# Altium schematic sheet CurrentSense_InputProcessing.SchDoc
size A; SheetNumber: 4; SheetTotal: 5
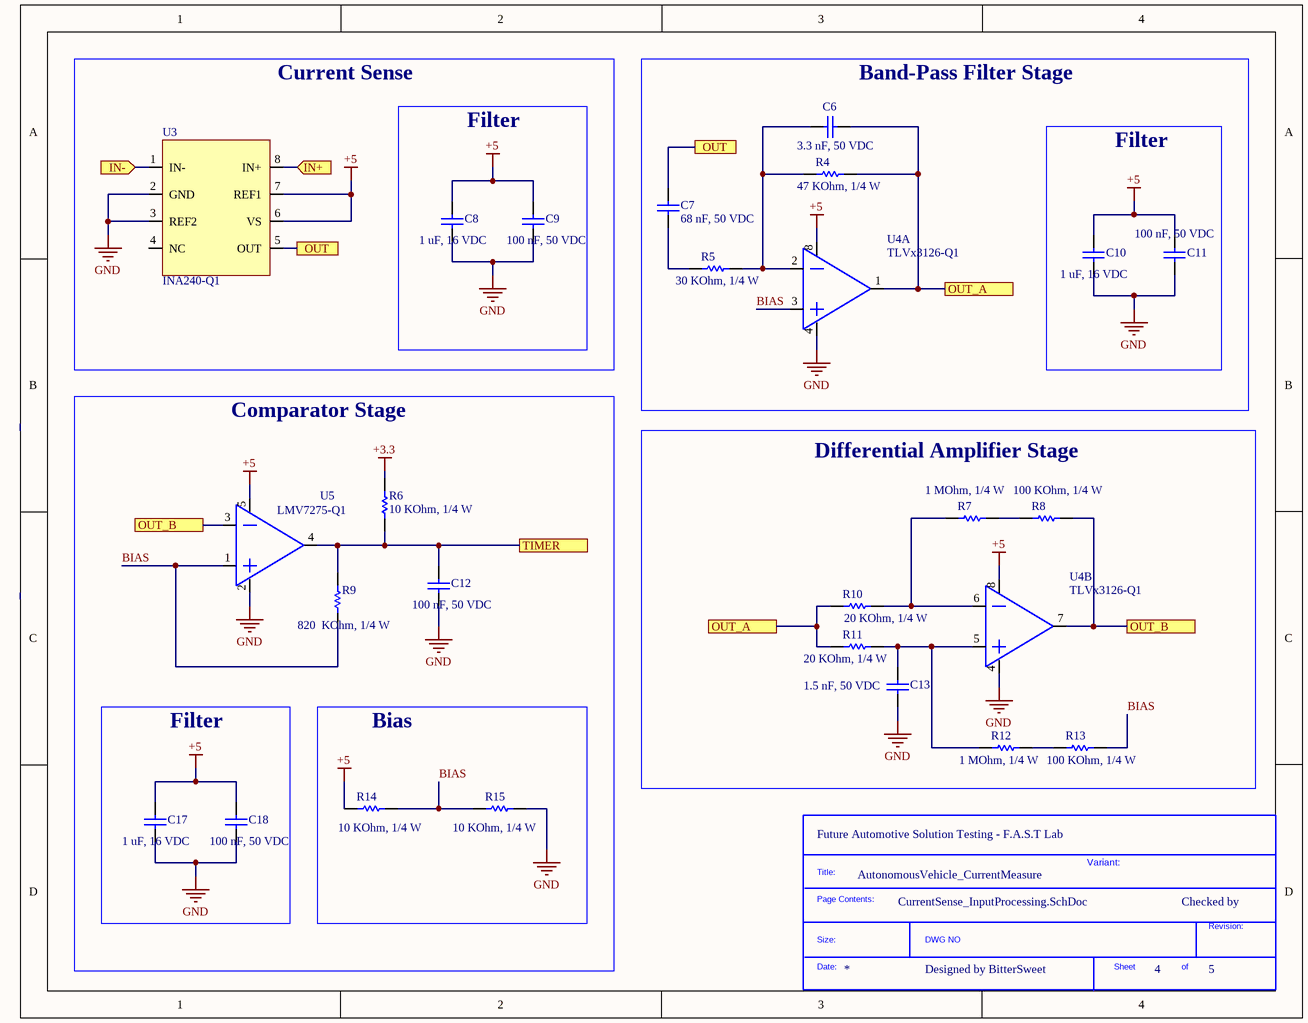
[diagram p0: CurrentSense_InputProcessing.SchDoc]

## Parts
*?  SDTitleBlock  (value not drawn)  (graphical)
C6  3.3 nF, 50 VDC  [CAP_0603]
C7  68 nF, 50 VDC  [CAP_0603]
C8  1 uF, 16 VDC  [CAP_0603]
C9  100 nF, 50 VDC  [CAP_0603]
C10  1 uF, 16 VDC  [CAP_0603]
C11  100 nF, 50 VDC  [CAP_0603]
C12  100 nF, 50 VDC  [CAP_0603]
C13  1.5 nF, 50 VDC  [CAP_0603]
C17  1 uF, 16 VDC  [CAP_0603]
C18  100 nF, 50 VDC  [CAP_0603]
R4  47 KOhm, 1/4 W  [resistor_0603]
R5  30 KOhm, 1/4 W  [resistor_0603]
R6  10 KOhm, 1/4 W  [resistor_0603]
R7  1 MOhm, 1/4 W  [resistor_0603]
R8  100 KOhm, 1/4 W  [resistor_0603]
R9  820  KOhm, 1/4 W  [resistor_0603]
R10  20 KOhm, 1/4 W  [resistor_0603]
R11  20 KOhm, 1/4 W  [resistor_0603]
R12  1 MOhm, 1/4 W  [resistor_0603]
R13  100 KOhm, 1/4 W  [resistor_0603]
R14  10 KOhm, 1/4 W  [resistor_0603]
R15  10 KOhm, 1/4 W  [resistor_0603]
U3  INA240-Q1  [INA240-Q1-SOIC-8]
U4  TLVx3126-Q1  [TLVx316-Q1-VSSOP8]  (parts A,B of 2)
U5  LMV7275-Q1  [LMV7275-Q1]

## Blocks framed on the sheet
Current Sense: U3
Band-Pass Filter Stage: C6 C7 R4 R5 U4
Filter: C8 C9
Filter: C10 C11
Comparator Stage: C12 R6 R9 U5
Differential Amplifier Stage: C13 R7 R8 R10-R13 U4
Filter: C17 C18
Bias: R14 R15

## Ports
IN+ (in), IN- (in), OUT, OUT_A, OUT_B, TIMER

## Nets
+3.3: R6.2
+5: C8.2 C9.2 C10.2 C11.2 C17.2 C18.2 R14.2 U3.6(VS) U3.7(REF1) U4.8(VCC) U5.5(V+)
GND: C8.1 C9.1 C10.1 C11.1 C12.1 C13.1 C17.1 C18.1 R15.1 U3.2(GND) U3.3(REF2) U4.4(GND) U5.2(V-)
BIAS: R9.1 R13.2 R14.1 R15.2 U4.3(INA+) U5.1(IN+)
IN+: U3.8(IN+) ; port IN+
IN-: U3.1(IN-) ; port IN-
OUT: C7.2 U3.5(OUT) ; port OUT
OUT_A: C6.2 R4.2 R10.1 R11.1 U4.1(OUTA) ; port OUT_A
OUT_B: R8.2 U4.7(OUTB) U5.3(IN-) ; port OUT_B
TIMER: C12.2 R6.1 R9.2 U5.4(OUT) ; port TIMER
NetC6_1: C6.1 R4.1 R5.2 U4.2(INA-)
NetC7_1: C7.1 R5.1
NetC13_2: C13.2 R11.2 R12.1 U4.5(INB+)
NetR7_1: R7.1 R10.2 U4.6(INB-)
NetR7_2: R7.2 R8.1
NetR12_2: R12.2 R13.1

Not connected (* = marked no-connect by the designer): U3 4(NC)

## Notes on the sheet
- (near *?) Future Automotive Solution Testing - F.A.S.T Lab
- AutonomousVehicle_CurrentMeasure
- Variant:
- Checked by
- Designed by BitterSweet
- (in symbol SDTitleBlock) Title:; Page Contents:; Revision:; Size:; DWG NO; Date:; Sheet; of

## Library data of the parts
C6 = 0106033320550: CAP, size 0603, 3.3 nF, 50 VDC; Manufacture Name: TDK; Manufacture SN: CGA3E2C0G1H332J080AE; Capacitance: 3.3 nF; Tolerance: +/-5%; Voltage Rating DC: 50 VDC; ComponentLink2Description: Datasheet; ComponentLink2URL: https://product.tdk.com/system/files/dam/doc/product/capacitor/ceramic/mlcc/catalog/mlcc_automotive_soft_en.pdf?ref_disty=mouser; Operating Temperature: -55 to +125degC; Packaging: Tape and Reel; Mounting Technology: SMT; Size: 0603; Supplier 1 Name: Mouser; Supplier 1 SN: 810-CGA3E2C0G1H332J8; Supplier 1 URL: https://www.mouser.com/ProductDetail/TDK/CGA3E2C0G1H332J080AE?qs=P1JMDcb91o59%252BuVOytSHFw%3D%3D&utm_source=mouser-refine-download&utm_medium=file&utm_campaign=CGA3E2C0G1H332J080AE&utm_content=TDK; Supplier 2 Name: Digi-Key; Supplier 2 SN: 445-CGA3E2C0G1H332J080AETR-ND; Supplier 2 URL: https://www.digikey.com/en/products/detail/tdk-corporation/cga3e2c0g1h332j080ae/11697916; Supplier 3 Name: thegioiic; Supplier 3 SN: N/A; Supplier 3 URL: https://www.thegioiic.com/tu-gom-0603-3-3nf-50v; Value: 3.3 nF, 50 VDC
C7 = 0106036831050: CAP, size 0603, 68 nF, 50 VDC; Manufacture Name: TDK; Manufacture SN: CGA3E2X7R1H683K080AA; Capacitance: 68 nF; Tolerance: +/-10%; Voltage Rating DC: 50 VDC; ComponentLink2Description: Datasheet; ComponentLink2URL: https://product.tdk.com/system/files/dam/doc/product/capacitor/ceramic/mlcc/catalog/mlcc_automotive_general_en.pdf?ref_disty=mouser; Operating Temperature: -55 to +125degC; Packaging: Tape and Reel; Mounting Technology: SMT; Size: 0603; Supplier 1 Name: Mouser; Supplier 1 SN: 810-CGA3E2X7R1H683K; Supplier 1 URL: https://www.mouser.com/ProductDetail/TDK/CGA3E2X7R1H683K080AA?qs=NRhsANhppD%252BWyOHUcAY%252Bxg%3D%3D&utm_source=mouser-refine-download&utm_medium=file&utm_campaign=CGA3E2X7R1H683K080AA&utm_content=TDK; Supplier 2 Name: Digi-Key; Supplier 2 SN: 445-5665-2-ND; Supplier 2 URL: https://www.digikey.com/en/products/detail/tdk-corporation/cga3e2x7r1h683k080aa/2443143; Supplier 3 Name: thegioiic; Supplier 3 SN: N/A; Supplier 3 URL: https://www.thegioiic.com/tu-gom-0603-68nf-50v; Value: 68 nF, 50 VDC
C8 C10 C17 = 0106031051016: CAP, size 0603, 1 uF, 16 VDC; Manufacture Name: Samsung Electro-Mechanics; Manufacture SN: CL10B105KO8NNWC; Capacitance: 1 uF; Tolerance: +/-10%; Voltage Rating DC: 16 VDC; ComponentLink2Description: Datasheet; ComponentLink2URL: https://www.mouser.vn/datasheet/2/585/Samsung_MLCC_1837944-1929650.pdf; Operating Temperature: -55 to +125degC; Packaging: Tape and Reel; Mounting Technology: SMT; Size: 0603; Supplier 1 Name: Mouser; Supplier 1 SN: 187-CL10B105KO8NNWC; Supplier 1 URL: https://www.mouser.vn/ProductDetail/Samsung-Electro-Mechanics/CL10B105KO8NNWC?qs=81r%252BiQLm7BT%252BXtc72qn1ug%3D%3D&utm_source=mouser-refine-download&utm_medium=file&utm_campaign=CL10B105KO8NNWC&utm_content=Samsung-Electro-Mechanics; Supplier 2 Name: Digi-Key; Supplier 2 SN: 1276-CL10B105KO8NNWCTR-ND; Supplier 2 URL: https://www.digikey.com/en/products/detail/samsung-electro-mechanics/cl10b105ko8nnwc/16572783; Supplier 3 Name: thegioiic; Supplier 3 SN: N/A; Supplier 3 URL: https://www.thegioiic.com/tu-gom-0603-1uf-16v; Value: 1 uF, 16 VDC
C9 C11 C12 C18 = 0106031041050: CAP, size 0603, 100 nF, 50 VDC; Manufacture Name: TDK; Manufacture SN: CGA3E3X8R1H104K080AE; Capacitance: 100 nF; Tolerance: +/-10%; Voltage Rating DC: 50 VDC; ComponentLink2Description: Datasheet; ComponentLink2URL: https://product.tdk.com/system/files/dam/doc/product/capacitor/ceramic/mlcc/catalog/mlcc_automotive_soft_en.pdf?ref_disty=mouser; Operating Temperature: -55 to +125degC; Packaging: Tape and Reel; Mounting Technology: SMT; Size: 0603; Supplier 1 Name: Mouser; Supplier 1 SN: 810-CGA3E3X8R1H104KA; Supplier 1 URL: https://www.mouser.com/ProductDetail/TDK/CGA3E3X8R1H104K080AE?qs=nQSIdc08i%252Bd8g3IRRgU2bw%3D%3D&utm_source=mouser-refine-download&utm_medium=file&utm_campaign=CGA3E3X8R1H104K080AE&utm_content=TDK; Supplier 2 Name: Digi-Key; Supplier 2 SN: 445-173697-2-ND; Supplier 2 URL: https://www.digikey.com/en/products/detail/tdk-corporation/cga3e3x8r1h104k080ae/5809262; Supplier 3 Name: thegioiic; Supplier 3 SN: N/A; Supplier 3 URL: N/Ahttps://www.thegioiic.com/tu-gom-0603-100nf-0-1uf-50v; Value: 100 nF, 50 VDC
C13 = 0106031521050: CAP, size 0603, 1.5 nF, 50 VDC; Manufacture Name: TDK; Manufacture SN: CGA3E2X7R1H152K080AA; Capacitance: 1.5 nF; Tolerance: +/-10%; Voltage Rating DC: 50 VDC; ComponentLink2Description: Datasheet; ComponentLink2URL: https://product.tdk.com/system/files/dam/doc/product/capacitor/ceramic/mlcc/catalog/mlcc_automotive_general_en.pdf?ref_disty=mouser; Operating Temperature: -55 to +125degC; Packaging: Tape and Reel; Mounting Technology: SMT; Size: 0603; Supplier 1 Name: Mouser; Supplier 1 SN: 810-CGA3E2X7R1H152K; Supplier 1 URL: https://www.mouser.com/ProductDetail/TDK/CGA3E2X7R1H152K080AA?qs=NRhsANhppD%2FNdlvuo0XOnQ%3D%3D&utm_source=mouser-refine-download&utm_medium=file&utm_campaign=CGA3E2X7R1H152K080AA&utm_content=TDK; Supplier 2 Name: Digi-Key; Supplier 2 SN: 445-6920-2-ND; Supplier 2 URL: https://www.digikey.com/en/products/detail/tdk-corporation/cga3e2x7r1h152k080aa/2672813; Supplier 3 Name: thegioiic; Supplier 3 SN: N/A; Supplier 3 URL: https://www.thegioiic.com/tu-gom-0603-1-5nf-50v; Value: 1.5 nF, 50 VDC
R4 = 0006034701: RES, size 0603, 47 Ohm, 1/4 W; Manufacture  Name: OEM; Rated Power: 1/4 W; Resistance: 47 KOhm; Resistance Tolerance: +/-1%; Size: 0603; Mounting Technology: SMT; Supplier 1 Name: Mouser; Supplier 1 SN: 667-ERJ-UP3F47R0V; Supplier 1 URL: https://www.mouser.vn/ProductDetail/Panasonic/ERJ-UP3F47R0V?qs=GedFDFLaBXE9d1Rnv%2Fokmg%3D%3D; Supplier 2 Name: Digi-Key; Supplier 2 SN: 10-ERJ-UP3F47R0VTR-ND - Tape & Reel (TR); Supplier 3 Name: thegioiic; Supplier 3 SN: N/A; Supplier 3 URL: https://www.thegioiic.com/dien-tro-47-kohm-0603-1-; Manufacture  SN: OEM; Value: 47 KOhm, 1/4 W; ComponentLink1Description: Datasheet link; ComponentLink1URL: https://www.mouser.vn/datasheet/2/315/Panasonic_Resistors_Thick_Film_Anti_Sulf_Anti_Surg-1825099.pdf; ComponentLink2Description: Supplier 1 URL; ComponentLink2URL: N/A; ComponentLink3Description: Supplier 2 URL; ComponentLink3URL: https://www.digikey.com/en/products/detail/panasonic-electronic-components/ERJ-UP3F47R0V/12092512?s=N4IgTCBcDaIGxwOwFoCiAlAUsgqgBQGYAxAFkXQAYA1EAXQF8g; ComponentLink4Description: Supplier 3 URL; ComponentLink4URL: N/A; Supplier 2 URL: https://www.digikey.com/en/products/detail/panasonic-electronic-components/ERJ-UP3F47R0V/12092512?s=N4IgTCBcDaIGxwOwFoCiAlAUsgqgBQGYAxAFkXQAYA1EAXQF8g
R5 = 0006032345: RES, size 0603, 230 KOhm, 1/4 W; Manufacture  Name: OEM; Rated Power: 1/4 W; Resistance Tolerance: +/-1%; Size: 0603; Mounting Technology: SMT; Resistance: 230 KOhm; Supplier 1 Name: Mouser; Supplier 1 SN: N/A; Supplier 1 URL: N/A; Supplier 2 Name: Digi-Key; Supplier 2 SN: N/A; Supplier 3 Name: thegioiic; Supplier 3 SN: N/A; Supplier 3 URL: https://www.thegioiic.com/dien-tro-30-kohm-0603-1-; Manufacture  SN: OEM; Value: 30 KOhm, 1/4 W; ComponentLink1Description: Datasheet link; ComponentLink1URL: N/A; ComponentLink2Description: Supplier 1 URL; ComponentLink2URL: N/A; ComponentLink3Description: Supplier 2 URL; ComponentLink3URL: N/A; ComponentLink4Description: Supplier 3 URL; ComponentLink4URL: N/A; Supplier 2 URL: N/A
R6 R14 R15 = 0006031031: RES, size 0603, 10 KOhm, 1/4 W; Manufacture  Name: OEM; Resistance: 10 KOhm; Rated Power: 1/4 W; Resistance Tolerance: +/-1%; Size: 0603; Mounting Technology: SMT; Supplier 1 Name: Mouser; Supplier 1 SN: 755-ESR03EZPF1002; Supplier 2 Name: Digi-Key; Supplier 2 SN: RHM10KADTR-ND RHM10KADCT-ND RHM10KADDKR-ND; Supplier 1 URL: https://www.mouser.vn/ProductDetail/ROHM-Semiconductor/ESR03EZPF1002?qs=sGAEpiMZZMvdGkrng054t67Efho1F8r6CDeAsqwFse8%3D; Supplier 3 Name: thegioiic; Supplier 3 SN: N/A; Supplier 3 URL: https://www.thegioiic.com/dien-tro-10-kohm-0603-1-; Manufacture  SN: OEM; Value: 10 KOhm, 1/4 W; ComponentLink1Description: Datasheet link; ComponentLink1URL: https://fscdn.rohm.com/en/products/databook/datasheet/passive/resistor/chip_resistor/esr-e.pdf; ComponentLink2Description: Supplier 1 URL; ComponentLink2URL: N/A; ComponentLink3Description: Supplier 2 URL; ComponentLink3URL: https://www.digikey.com/en/products/detail/rohm-semiconductor/ESR03EZPF1002/1983429; ComponentLink4Description: Supplier 3 URL; ComponentLink4URL: N/A; Supplier 2 URL: https://www.digikey.com/en/products/detail/rohm-semiconductor/ESR03EZPF1002/1983429
R7 R12 = 0006031051: RES, size 0603, 1 MOhm, 1/4 W; Manufacture  Name: OEM; Resistance: 1 MOhm; Rated Power: 1/4 W; Resistance Tolerance: +/-1%; Size: 0603; Mounting Technology: SMT; Supplier 1 Name: Mouser; Supplier 1 SN: 71-RCS06031M00FKEA; Supplier 2 Name: Digi-Key; Supplier 2 SN: 541-2803-2-ND 541-2803-1-ND 541-2803-6-ND; Supplier 1 URL: https://www.mouser.vn/ProductDetail/Vishay-Dale/RCS06031M00FKEA?qs=sGAEpiMZZMvdGkrng054t9clqp6gtJJdWojIF5doOmwdMUlAJJ6Dlw%3D%3D; Supplier 3 Name: thegioiic; Supplier 3 SN: N/A; Supplier 3 URL: https://www.thegioiic.com/dien-tro-1-mohm-0603-1-; Manufacture  SN: OEM; Value: 1 MOhm, 1/4 W; ComponentLink1Description: Datasheet link; ComponentLink1URL: https://www.vishay.com/docs/20065/rcse3.pdf; ComponentLink2Description: Supplier 1 URL; ComponentLink2URL: N/A; ComponentLink3Description: Supplier 2 URL; ComponentLink3URL: https://www.digikey.com/en/products/detail/vishay-dale/RCS06031M00FKEA/5866949; ComponentLink4Description: Supplier 3 URL; ComponentLink4URL: N/A; Supplier 2 URL: https://www.digikey.com/en/products/detail/vishay-dale/RCS06031M00FKEA/5866949
R8 R13 = 0006031041: RES, size 0603, 100 KOhm, 1/4 W; Manufacture  Name: OEM; Rated Power: 1/4 W; Resistance Tolerance: +/-1%; Resistance: 100 KOhm; Size: 0603; Mounting Technology: SMT; Supplier 1 Name: Mouser; Supplier 1 SN: 603-SR0603FR-7T100KL; Supplier 2 Name: Digi-Key; Supplier 2 SN: YAG5821TR-ND YAG5821CT-ND YAG5821DKR-ND; Supplier 1 URL: https://www.mouser.vn/ProductDetail/YAGEO/SR0603FR-7T100KL?qs=sGAEpiMZZMvdGkrng054tz1y1XEHv7sNa%252BA%2F4WiDMf7aGw4zRBb%2FFQ%3D%3D; Supplier 3 Name: thegioiic; Supplier 3 SN: N/A; Supplier 3 URL: https://www.thegioiic.com/dien-tro-100-kohm-0603-1-; Manufacture  SN: OEM; Value: 100 KOhm, 1/4 W; ComponentLink1Description: Datasheet link; ComponentLink1URL: https://www.yageo.com/upload/media/product/productsearch/datasheet/rchip/PYu-SR_20105_RoHS_L_10.pdf; ComponentLink2Description: Supplier 1 URL; ComponentLink2URL: N/A; ComponentLink3Description: Supplier 2 URL; ComponentLink3URL: https://www.digikey.com/en/products/detail/yageo/SR0603FR-7T100KL/9373095; ComponentLink4Description: Supplier 3 URL; ComponentLink4URL: N/A; Supplier 2 URL: https://www.digikey.com/en/products/detail/yageo/SR0603FR-7T100KL/9373095
R9 = 0006038251: RES, size 0603, 820  KOhm, 1/4 W; Manufacture  Name: OEM; Rated Power: 1/4 W; Resistance Tolerance: +/-1%; Size: 0603; Mounting Technology: SMT; Resistance: 820  KOhm; Supplier 1 Name: Mouser; Supplier 1 SN: 660-HV731JTTD8204F; Supplier 1 URL: https://www.mouser.vn/ProductDetail/KOA-Speer/HV731JTTD8204F?qs=ZqVPfSd1khqN0teaqWW7DA%3D%3D; Supplier 2 Name: Digi-Key; Supplier 2 SN: 13-RC0603FR-078M2LTR-ND; Supplier 3 Name: thegioiic; Supplier 3 SN: N/A; Supplier 3 URL: https://www.thegioiic.com/product/dien-tro-dan-smd?prid=6628,4725; Manufacture  SN: OEM; Value: 820  KOhm, 1/4 W; ComponentLink1Description: Datasheet link; ComponentLink1URL: N/A; ComponentLink2Description: Supplier 1 URL; ComponentLink2URL: N/A; ComponentLink3Description: Supplier 2 URL; ComponentLink3URL: https://www.digikey.com/en/products/detail/yageo/RC0603FR-078M2L/5918418; ComponentLink4Description: Supplier 3 URL; ComponentLink4URL: N/A; Supplier 2 URL: https://www.digikey.com/en/products/detail/yageo/RC0603FR-078M2L/5918418
R10 R11 = 0006032035: RES, size 0603, 20 KOhm, 1/4 W; Manufacture  Name: Panasonic; Manufacture  SN: ERJ-UP3J203V; Rated Power: 1/4 W; Resistance: 20 KOhm; Resistance Tolerance: +/-5%; Size: 0603; Mounting Technology: SMT; Supplier 1 Name: Mouser; Supplier 1 SN: 667-ERJ-UP3J203V; Supplier 1 URL: https://www.mouser.vn/datasheet/2/315/Panasonic_Resistors_Thick_Film_Anti_Sulf_Anti_Surg-1825099.pdf; Supplier 2 Name: Digi-Key; Supplier 2 SN: 10-ERJ-UP3J203VTR-ND - Tape & Reel (TR); Supplier 3 Name: thegioiic; Supplier 3 SN: N/A; Supplier 3 URL: https://www.thegioiic.com/dien-tro-20-kohm-0603-1-; Value: 20 KOhm, 1/4 W; ComponentLink1Description: Datasheet link; ComponentLink1URL: https://www.mouser.vn/datasheet/2/315/Panasonic_Resistors_Thick_Film_Anti_Sulf_Anti_Surg-1825099.pdf; ComponentLink2Description: Supplier 1 URL; ComponentLink2URL: N/A; ComponentLink3Description: Supplier 2 URL; ComponentLink3URL: https://www.digikey.com/en/products/detail/panasonic-electronic-components/ERJ-UP3J203V/12092736?s=N4IgTCBcDaIGxwOwFoCiAlAUsgqgBQGZMwAGAgNRAF0BfIA; ComponentLink4Description: Supplier 3 URL; ComponentLink4URL: N/A; Supplier 2 URL: https://www.digikey.com/en/products/detail/panasonic-electronic-components/ERJ-UP3J203V/12092736?s=N4IgTCBcDaIGxwOwFoCiAlAUsgqgBQGZMwAGAgNRAF0BfIA
U3 = INA240-Q1: INA240-Q1 AEC-Q100, –4-V to 80-V, Bidirectional, Ultra-Precise Current Sense Amplifier With Enhanced PWM Rejection
U4 = TLVx3126-Q1: TLVx316-Q1 10-MHz, Rail-to-Rail Input/Output, Low-Voltage, 1.8-V CMOS Operational Amplifiers
U5 = LMV7275-Q1: LMV7275-Q1 Automotive Single 1.8-V Low Power Comparator With Rail-to-Rail Input. SC-70 package.